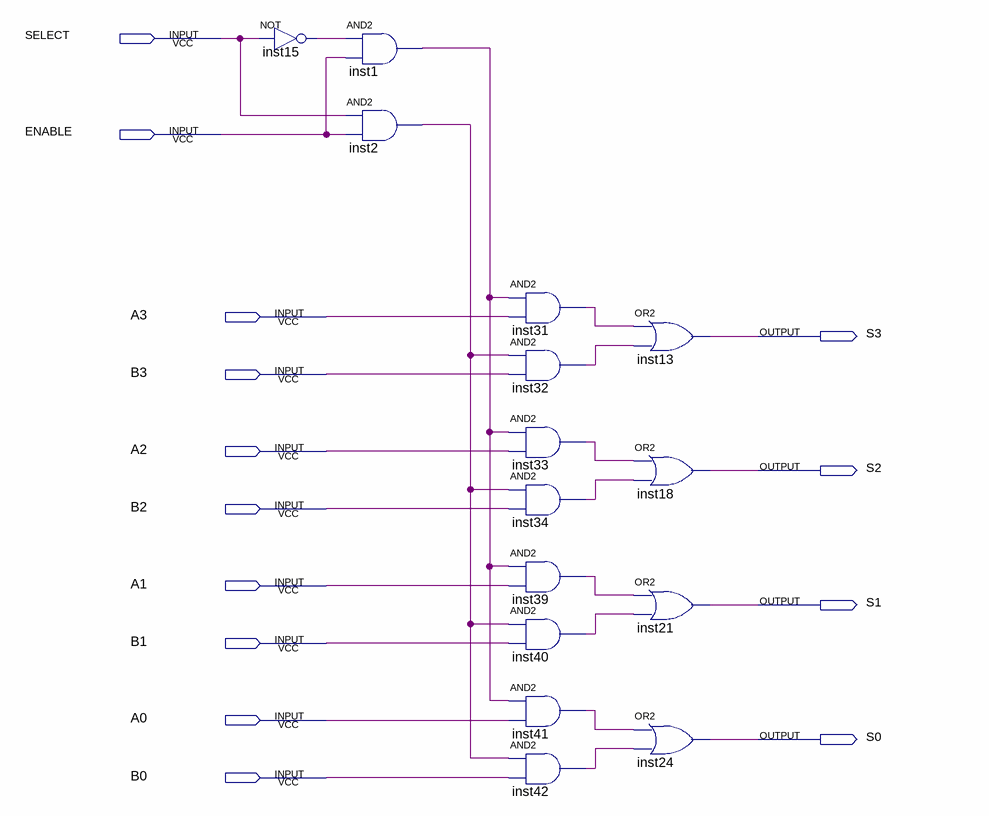
[diagram p0: schematic sheet]
// Quartus schematic MuxDuplode4bits.bdf as structural Verilog: 15 symbols, 14 pins
module MuxDuplode4bits (
  input  SELECT,
  input  ENABLE,
  input  A3,
  input  B3,
  input  A2,
  input  B2,
  input  A1,
  input  B1,
  input  A0,
  input  B0,
  output S3,
  output S2,
  output S1,
  output S0
);

  wire inst1_out, inst2_out, inst15_out, inst31_out, inst32_out, inst33_out, inst34_out, inst39_out,
       inst40_out, inst41_out, inst42_out;

  not inst15 (inst15_out, SELECT);
  and inst1 (inst1_out, inst15_out, ENABLE);
  and inst2 (inst2_out, SELECT, ENABLE);
  and inst31 (inst31_out, inst1_out, A3);
  and inst32 (inst32_out, inst2_out, B3);
  and inst33 (inst33_out, inst1_out, A2);
  and inst34 (inst34_out, inst2_out, B2);
  and inst39 (inst39_out, inst1_out, A1);
  and inst40 (inst40_out, inst2_out, B1);
  and inst41 (inst41_out, inst1_out, A0);
  and inst42 (inst42_out, inst2_out, B0);
  or inst13 (S3, inst31_out, inst32_out);
  or inst18 (S2, inst33_out, inst34_out);
  or inst21 (S1, inst39_out, inst40_out);
  or inst24 (S0, inst41_out, inst42_out);
endmodule
